# Altium project Coaster.PrjPcb
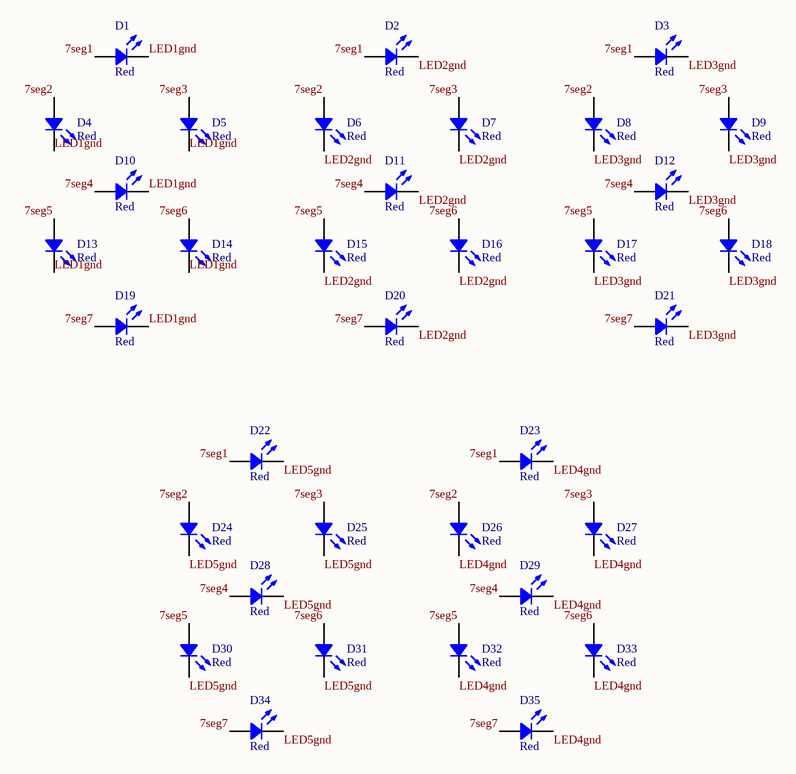
[diagram p0: Sheet2.SchDoc]
1 sheet, 35 parts. Net scope: global (net labels, ports and power ports of the same name join across sheets).

## Sheet Sheet2.SchDoc
size A; SheetNumber: 1; SheetTotal: 1

### Parts
D1  Red  [LED 0805_2012 RED]
D2  Red  [LED 0805_2012 RED]
D3  Red  [LED 0805_2012 RED]
D4  Red  [LED 0805_2012 RED]
D5  Red  [LED 0805_2012 RED]
D6  Red  [LED 0805_2012 RED]
D7  Red  [LED 0805_2012 RED]
D8  Red  [LED 0805_2012 RED]
D9  Red  [LED 0805_2012 RED]
D10  Red  [LED 0805_2012 RED]
D11  Red  [LED 0805_2012 RED]
D12  Red  [LED 0805_2012 RED]
D13  Red  [LED 0805_2012 RED]
D14  Red  [LED 0805_2012 RED]
D15  Red  [LED 0805_2012 RED]
D16  Red  [LED 0805_2012 RED]
D17  Red  [LED 0805_2012 RED]
D18  Red  [LED 0805_2012 RED]
D19  Red  [LED 0805_2012 RED]
D20  Red  [LED 0805_2012 RED]
D21  Red  [LED 0805_2012 RED]
D22  Red  [LED 0805_2012 RED]
D23  Red  [LED 0805_2012 RED]
D24  Red  [LED 0805_2012 RED]
D25  Red  [LED 0805_2012 RED]
D26  Red  [LED 0805_2012 RED]
D27  Red  [LED 0805_2012 RED]
D28  Red  [LED 0805_2012 RED]
D29  Red  [LED 0805_2012 RED]
D30  Red  [LED 0805_2012 RED]
D31  Red  [LED 0805_2012 RED]
D32  Red  [LED 0805_2012 RED]
D33  Red  [LED 0805_2012 RED]
D34  Red  [LED 0805_2012 RED]
D35  Red  [LED 0805_2012 RED]

### Nets
7seg1: D1.1 D2.1 D3.1 D22.1 D23.1
7seg2: D4.1 D6.1 D8.1 D24.1 D26.1
7seg3: D5.1 D7.1 D9.1 D25.1 D27.1
7seg4: D10.1 D11.1 D12.1 D28.1 D29.1
7seg5: D13.1 D15.1 D17.1 D30.1 D32.1
7seg6: D14.1 D16.1 D18.1 D31.1 D33.1
7seg7: D19.1 D20.1 D21.1 D34.1 D35.1
LED1gnd: D1.2 D4.2 D5.2 D10.2 D13.2 D14.2 D19.2
LED2gnd: D2.2 D6.2 D7.2 D11.2 D15.2 D16.2 D20.2
LED3gnd: D3.2 D8.2 D9.2 D12.2 D17.2 D18.2 D21.2
LED4gnd: D23.2 D26.2 D27.2 D29.2 D32.2 D33.2 D35.2
LED5gnd: D22.2 D24.2 D25.2 D28.2 D30.2 D31.2 D34.2

### Library data of the parts
D1-D35 = SML-LXT0805SRW-TR: LED RED DIFFUSED SMD; Manufacturer: Lumex Opto/Components Inc.; Configuration: Standard; Current - Test: 20mA; Lens Color: White; Lens Size: 1.30mm x 1.25mm; Lens Style: Rectangle with Flat Top; Millicandela Rating: 21mcd; Viewing Angle: 140°; Voltage - Forward (Vf) (Typ): 1.8V; Wavelength - Peak: 660nm; Part Number: SML-LXT0805SRW-TR; Color: Red; ComponentLink1Description: Datasheet; ComponentLink1URL: https://www.lumex.com/content/files/ProductAttachment/SML-LXT0805SRW-TR.pdf; ComponentLink2Description: DigiKey Link; ComponentLink2URL: http://digikey.com/product-detail/en/lumex-opto-components-inc/SML-LXT0805SRW-TR/67-1555-1-ND/304372; Device Package: 0805 (2012 Metric); Height (Max): 0.80mm; LastUpdated: 9/2/2020 1:21:01 AM; Lens Transparency: Diffused; Lifecycle Status: Active; Minimum Order: 1; Mounting Type: Surface Mount; Package / Case: 0805 (2012 Metric); Packaging: TapeAndReel; PartId: 311; Part Status: Active; Price: 0.07; Series: -; Size / Dimension: 2.00mm L x 1.25mm W; Supplier 1: DigiKey; Supplier Part Number 1: 67-1555-1-ND; Value: Red